# EAGLE design pidcontroller-less-pins (EAGLE 6.4)
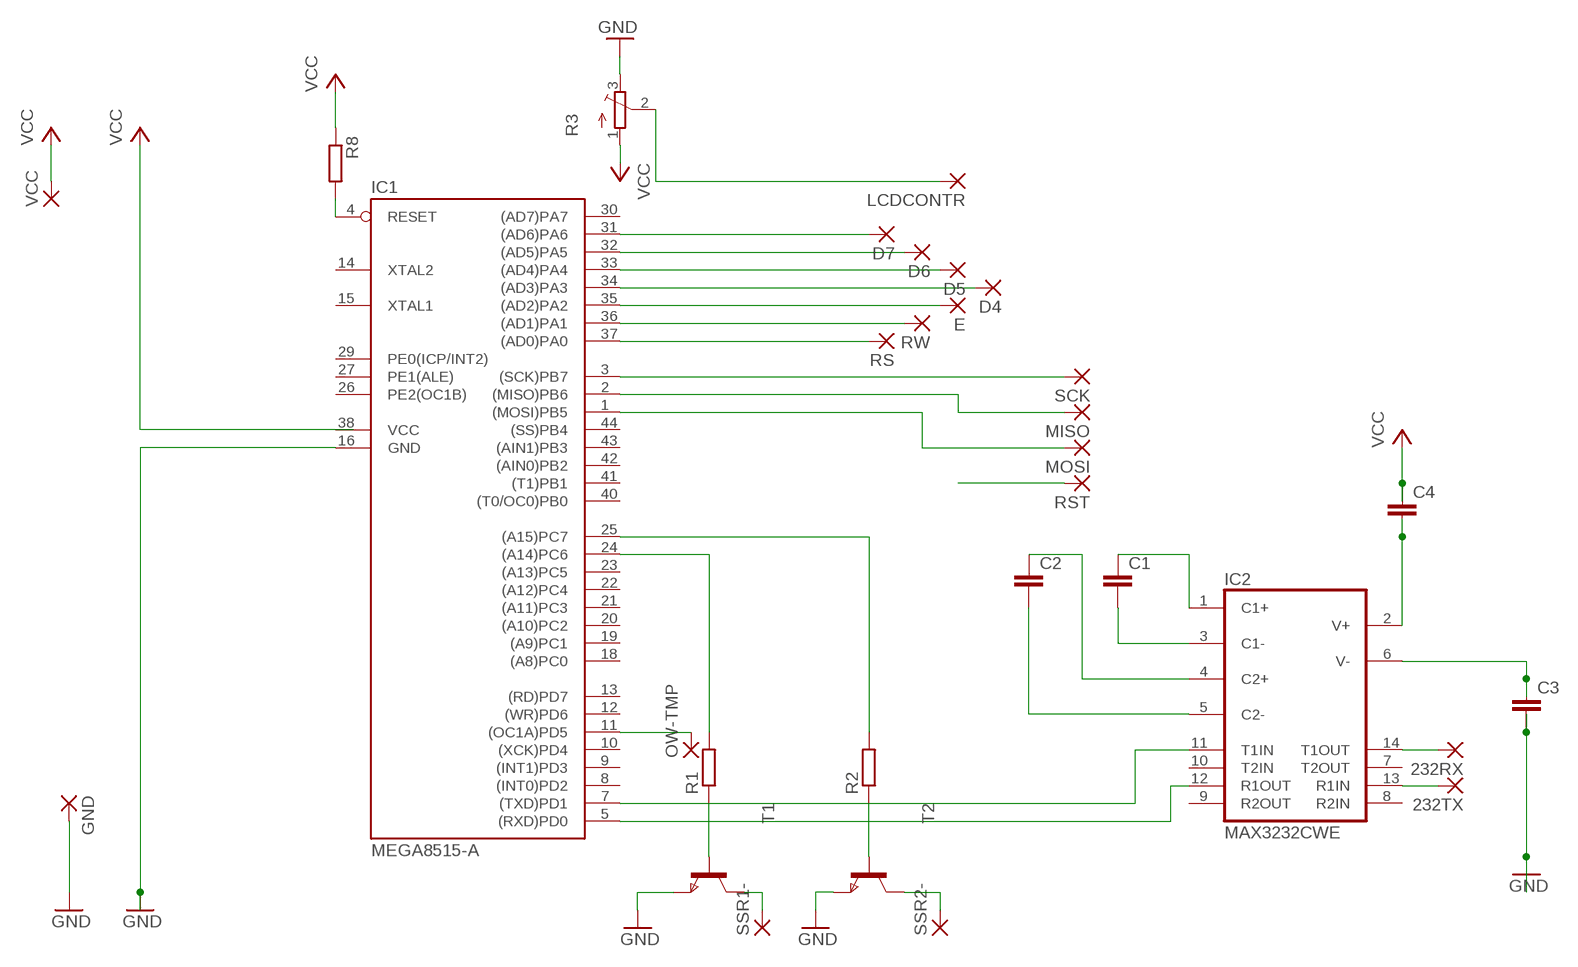
[diagram p0: schematic, sheet 1]

## Parts
232RX  2,54/1,0  [2,54/1,0]
232TX  2,54/1,0  [2,54/1,0]
C1  C-EUC1206  [C1206]
C2  C-EUC1206  [C1206]
C3  C-EUC1206  [C1206]
C4  C-EUC1206  [C1206]
D4  2,54/1,0  [2,54/1,0]
D5  2,54/1,0  [2,54/1,0]
D6  2,54/1,0  [2,54/1,0]
D7  2,54/1,0  [2,54/1,0]
E  2,54/1,0  [2,54/1,0]
GND  2,54/1,0  [2,54/1,0]
IC1  MEGA8515-A  [TQFP44]
IC2  MAX3232CWE  [SO16L]
LCDCONTR  2,54/1,0  [2,54/1,0]
MISO  2,54/1,0  [2,54/1,0]
MOSI  2,54/1,0  [2,54/1,0]
OW-TMP  2,15/1,0  [2,15/1,0]
R1  R-EU_R0603  [R0603]
R2  R-EU_R0603  [R0603]
R3  TRIM_EU-SM-42/43B  [SM-42/43B]
R8  R-EU_R0603  [R0603]
RS  2,54/1,0  [2,54/1,0]
RST  2,54/1,0  [2,54/1,0]
RW  2,54/1,0  [2,54/1,0]
SCK  2,54/1,0  [2,54/1,0]
SSR1-  2,15/1,0  [2,15/1,0]
SSR2-  2,15/1,0  [2,15/1,0]
T1  NPNSOT23  [SOT-23]
T2  NPNSOT23  [SOT-23]
VCC  2,54/1,0  [2,54/1,0]

## Nets
1: D6.1(P) IC1.32((AD5)PA5)
GND: C3.2 GND.1(P) IC1.16(GND) R3.3(E) T1.2(E) T2.2(E)
N$1: IC1.3((SCK)PB7) SCK.1(P)
N$2: R1.1 T1.3(B)
N$3: R2.1 T2.3(B)
N$4: IC1.24((A14)PC6) R1.2
N$5: C2.2 IC2.5(C2-)
N$6: C2.1 IC2.4(C2+)
N$7: C1.2 IC2.3(C1-)
N$8: C1.1 IC2.1(C1+)
N$9: C4.2 IC2.2(V+)
N$10: IC1.25((A15)PC7) R2.2
N$11: C3.1 IC2.6(V-)
N$12: IC1.7((TXD)PD1) IC2.11(T1IN)
N$13: IC1.5((RXD)PD0) IC2.12(R1OUT)
N$14: IC1.2((MISO)PB6) MISO.1(P)
N$15: IC1.1((MOSI)PB5) MOSI.1(P)
N$16: IC1.37((AD0)PA0) RS.1(P)
N$17: IC1.36((AD1)PA1) RW.1(P)
N$18: E.1(P) IC1.35((AD2)PA2)
N$19: D4.1(P) IC1.34((AD3)PA3)
N$20: D5.1(P) IC1.33((AD4)PA4)
N$21: IC1.11((OC1A)PD5) OW-TMP.1(P)
N$22: D7.1(P) IC1.31((AD6)PA6)
N$23: SSR1-.1(P) T1.1(C)
N$24: SSR2-.1(P) T2.1(C)
N$25: 232RX.1(P) IC2.14(T1OUT)
N$26: 232TX.1(P) IC2.13(R1IN)
N$27: LCDCONTR.1(P) R3.2(S)
RESET: IC1.4(RESET) R8.2 RST.1(P)
VCC: C4.1 R3.1(A) R8.1 VCC.1(P)
Unconnected: IC1.6(NC1) IC1.8((INT0)PD2) IC1.9((INT1)PD3) IC1.10((XCK)PD4) IC1.12((WR)PD6) IC1.13((RD)PD7) IC1.14(XTAL2) IC1.15(XTAL1) IC1.17(NC2) IC1.18((A8)PC0) IC1.19((A9)PC1) IC1.20((A10)PC2) IC1.21((A11)PC3) IC1.22((A12)PC4) IC1.23((A13)PC5) IC1.26(PE2(OC1B)) IC1.27(PE1(ALE)) IC1.28(NC3) IC1.29(PE0(ICP/INT2)) IC1.30((AD7)PA7) IC1.39(NC4) IC1.40((T0/OC0)PB0) IC1.41((T1)PB1) IC1.42((AIN0)PB2) IC1.43((AIN1)PB3) IC1.44((SS)PB4) IC2.7(T2OUT) IC2.8(R2IN) IC2.9(R2OUT) IC2.10(T2IN)

## Power pins joined to a net without a drawn wire
GND: IC2.15(GND)
VCC: IC1.38(VCC) IC2.16(VCC)

## Library data of the parts
232RX 232TX D4-D7 E GND LCDCONTR MISO MOSI RS RST RW SCK VCC = wirepad:2,54/1,0: THROUGH-HOLE PAD
C1-C4 = resistor:C-EU: CAPACITOR, European symbol
IC1 = atmel:MEGA8515: MICROCONTROLLER 8 Kbytes FLASH 512 bytes SRAM 512 bytes EEPROM USART 8-channel 10 bit ADC Source: avr.lbr; MPN: ATMEGA8515-16AU; OC_FARNELL: 9171410; OC_NEWARK: 01M6904
IC2 = maxim:MAX3232*: True RS-232 Transceivers 3.0V to 5.5V, Low-Power up to 1Mbps, Using Four 0.1µF External Capacitors Source: http://pdfserv.maxim-ic.com/en/ds/MAX3222-MAX3241.pdf; MF: MAXIM; MPN: MAX3232CWE+; OC_FARNELL: 9725504; OC_NEWARK: 68K4630
OW-TMP SSR1- SSR2- = wirepad:2,15/1,0: THROUGH-HOLE PAD
R1 R2 R8 = resistor:R-EU_: RESISTOR, European symbol
R3 = pot:TRIM_EU-: POTENTIOMETER
T1 T2 = zetex:NPNSOT23: NPN TRANSISTOR; MPN: DSS20201L-7; OC_FARNELL: 1710688; OC_NEWARK: 25R4555

## Net classes
0 default: width 0.381 mm, drill 0.762 mm, clearance 0.381 mm

## Board
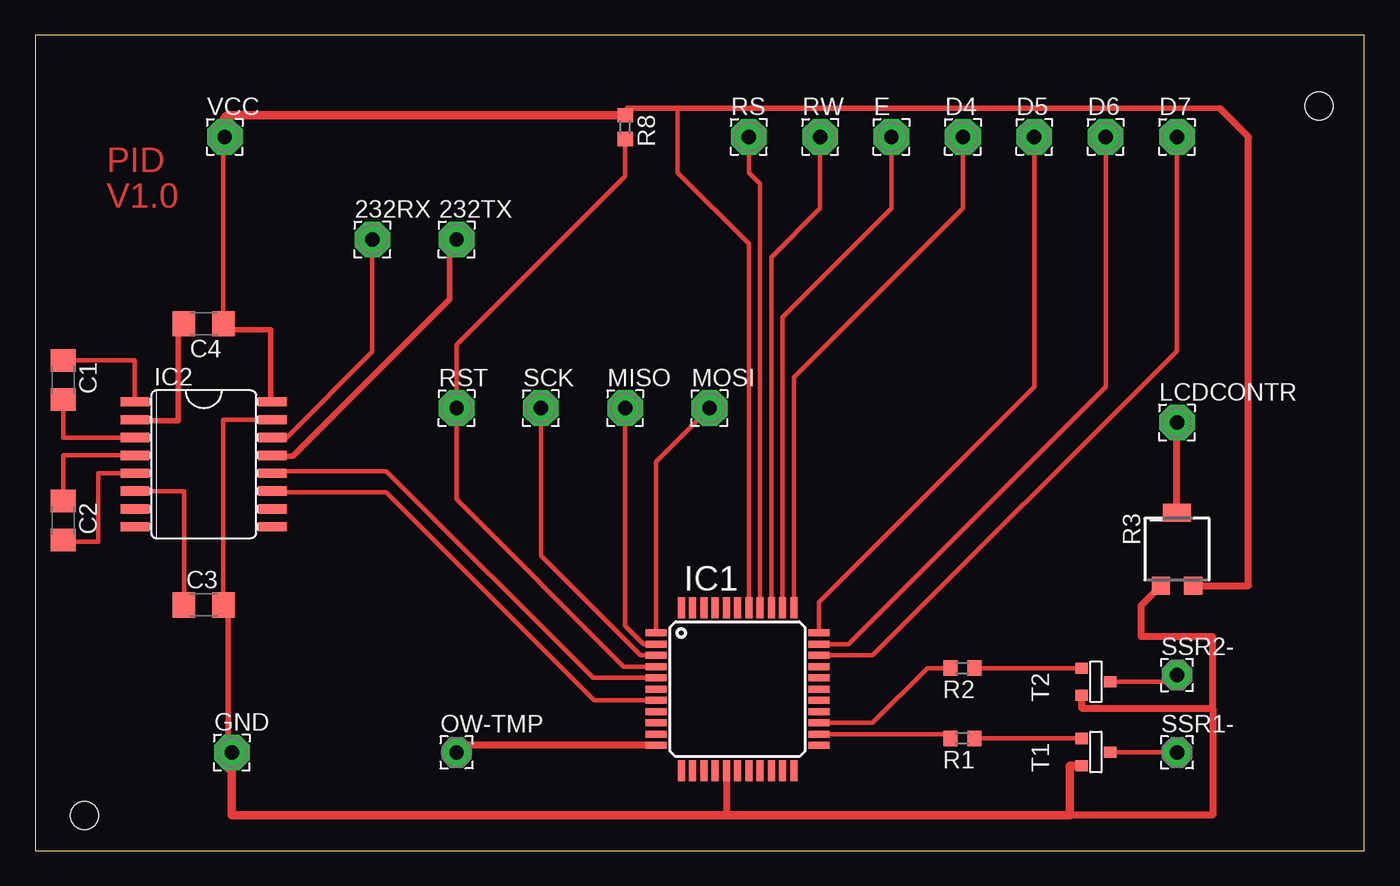
[diagram p1: board, top side]

Size 94.62 x 58.04 mm. Coordinates in mm from the lower left corner, seen from the top.
Outline: 0,0 94.62,0 94.62,58.04 0,58.04 0,0
Copper layers (1*16): Top 0.035mm / dielectric 1.5mm / Bottom 0.035mm
Design rules "default": minimum track width 10mil, minimum drill 24mil, track to track 8mil, track to pad 8mil, pad to pad 8mil, via to via 8mil, smd to smd 8mil, copper to edge 40mil, drill to drill 8mil, minimum pad ring 10mil, minimum via ring 8mil, stop-mask expansion 4mil, vias tented up to drill 0mil, thermal gap 10mil
Holes 2 mm at 3.5,2.5 91.4,53

### Footprints (pad centres in the part's own frame; a part is rotated, then mirrored left to right if it is on the bottom)
2,54/1,0 = drill 1.016 pad 2.54 octagon: 1 0,0
C1206 = smd 1.6 x 1.8: 1 -1.4,0; 2 1.4,0
TQFP44 = smd 1.5 x 0.5: 1 -5.8,4; 2 -5.8,3.2; 3 -5.8,2.4; 4 -5.8,1.6; 5 -5.8,0.8; 6 -5.8,0; 7 -5.8,-0.8; 8 -5.8,-1.6; 9 -5.8,-2.4; 10 -5.8,-3.2; 11 -5.8,-4; 23 5.8,-4; 24 5.8,-3.2; 25 5.8,-2.4; 26 5.8,-1.6; 27 5.8,-0.8; 28 5.8,0; 29 5.8,0.8; 30 5.8,1.6; 31 5.8,2.4; 32 5.8,3.2; 33 5.8,4 | smd 0.5 x 1.5: 12 -4,-5.8; 13 -3.2,-5.8; 14 -2.4,-5.8; 15 -1.6,-5.8; 16 -0.8,-5.8; 17 0,-5.8; 18 0.8,-5.8; 19 1.6,-5.8; 20 2.4,-5.8; 21 3.2,-5.8; 22 4,-5.8; 34 4,5.8; 35 3.2,5.8; 36 2.4,5.8; 37 1.6,5.8; 38 0.8,5.8; 39 0,5.8; 40 -0.8,5.8; 41 -1.6,5.8; 42 -2.4,5.8; 43 -3.2,5.8; 44 -4,5.8
SO16L = smd 0.66 x 2.032: 1 -4.445,-4.902; 2 -3.175,-4.902; 3 -1.905,-4.902; 4 -0.635,-4.902; 5 0.635,-4.902; 6 1.905,-4.902; 7 3.175,-4.902; 8 4.445,-4.902; 9 4.445,4.902; 10 3.175,4.902; 11 1.905,4.902; 12 0.635,4.902; 13 -0.635,4.902; 14 -1.905,4.902; 15 -3.175,4.902; 16 -4.445,4.902
2,15/1,0 = drill 1.016 pad 2.159 octagon: 1 0,0
R0603 = smd 1 x 1.1: 1 -0.85,0; 2 0.85,0
SM-42/43B = smd 1.3 x 1.3: 1 2.6,1.15; 3 2.6,-1.15 | smd 1.3 x 2: 2 -2.6,0
SOT-23 = smd 0.787 x 0.889: 1 0.025,-1.016; 2 -0.94,1.016; 3 0.991,1.016

### Placement (x,y rotation side)
232RX  24,43.5 0 top
232TX  30,43.5 0 top
C1  2,33.5 270 top
C2  2,23.5 270 top
C3  12,17.5 0 top
C4  12,37.5 180 top
D4  66.04,50.8 0 top
D5  71.12,50.8 0 top
D6  76.2,50.8 0 top
D7  81.28,50.8 0 top
E  60.96,50.8 0 top
GND  14,7 0 top
IC1  50,11.5 0 top
IC2  12,27.5 270 top
LCDCONTR  81.28,30.48 0 top
MISO  42,31.5 0 top
MOSI  48,31.5 0 top
OW-TMP  30,7 0 top
R1  66,8 180 top
R2  66,13 180 top
R3  81.28,21.46 270 top
R8  42,51.5 270 top
RS  50.8,50.8 0 top
RST  30,31.5 0 top
RW  55.88,50.8 0 top
SCK  36,31.5 0 top
SSR1-  81.28,7 0 top
SSR2-  81.28,12.5 0 top
T1  75.5,7 90 top
T2  75.5,12 90 top
VCC  13.5,50.8 0 top

### Tracks (layer width: path | path; a pad name or v marks a point on that pad's centre or on a via)
1
  Top 0.305: IC1.32 57.88,14.7 76.2,33.02 D6.1
GND
  Top 0.305: IC2.15 13.4,30.68 C3.2
  Top 0.381: C3.2 13.75,17.41 13.75,5.72 GND.1
  Top 0.508: IC1.16 49.2,2.54 48.26,2.54 | T2.2 74.48,10.16 83.82,10.16 | 83.82,10.16 83.82,2.54 73.66,2.54 | 83.82,10.16 83.82,15.24 78.74,15.24 78.74,17.47 R3.3
  Top 0.61: GND.1 14,2.54 48.26,2.54 73.66,2.54 73.66,6.06 T1.2
N$1
  Top 0.305: IC1.3 43.1,13.9 36,21 SCK.1
N$2
  Top 0.305: R1.1 T1.3
N$3
  Top 0.305: R2.1 T2.3
N$4
  Top 0.305: IC1.24 64.85,8.3 R1.2
N$5
  Top 0.305: IC2.5 4.5,26.86 4.5,22 2,22 C2.2
  Top 0.381: 2.06,21.98 C2.2
N$6
  Top 0.305: IC2.4 2,28.14 C2.1
  Top 0.381: 2.06,25.03 C2.1
N$7
  Top 0.305: IC2.3 2,29.41 C1.2
N$8
  Top 0.305: IC2.1 7.1,34.9 C1.1
N$9
  Top 0.381: C4.2 10.19,37.22 10.19,30.62 7.14,30.62 IC2.2
N$10
  Top 0.305: IC1.25 59.6,9.1 63.5,13 R2.2
N$11
  Top 0.305: IC2.6 10.6,25.59 C3.1
N$12
  Top 0.305: IC1.7 39.8,10.7 25,25.5 17,25.5 IC2.11
N$13
  Top 0.305: IC1.5 39.7,12.3 25,27 17.04,27 IC2.12
N$14
  Top 0.305: IC1.2 43.3,14.7 42,16 MISO.1
N$15
  Top 0.305: IC1.1 44.2,27.7 MOSI.1
N$16
  Top 0.305: IC1.37 51.6,47.46 50.8,48.26 RS.1
N$17
  Top 0.305: IC1.36 52.4,42.24 55.88,45.72 RW.1
N$18
  Top 0.305: IC1.35 53.2,37.96 60.96,45.72 E.1
N$19
  Top 0.305: IC1.34 54,33.68 66.04,45.72 D4.1
N$20
  Top 0.305: IC1.33 55.8,17.7 71.12,33.02 D5.1
N$21
  Top 0.508: IC1.11 30.5,7.5 OW-TMP.1
N$22
  Top 0.305: IC1.31 59.62,13.9 81.28,35.56 D7.1
N$23
  Top 0.305: T1.1 81.47,7.03 SSR1-.1
N$24
  Top 0.305: T2.1 81.03,12.03 SSR2-.1
N$25
  Top 0.305: IC2.14 17.91,29.41 24,35.5 232RX.1
N$26
  Top 0.381: IC2.13 17.3,28.08 18.32,28.08 29.5,39.25 29.5,43.32 232TX.1
N$27
  Top 0.508: R3.2 LCDCONTR.1
RESET
  Top 0.305: R8.2 42,48 30,36 RST.1 30,25 41.9,13.1 IC1.4
VCC
  Top 0.305: C4.1 13.4,51.9 VCC.1 | IC1.38 50.8,43.18 45.72,48.26 45.72,52.83
  Top 0.381: 13.75,37.22 C4.1 13.72,37.08 16.76,37.08 16.76,32 IC2.16 | 84.33,52.83 45.72,52.83 42.16,52.83 R8.1
  Top 0.508: R3.1 86.36,18.86 86.36,50.8 84.33,52.83
  Top 0.61: R8.1 13.85,52.35 arc90 13.4,51.9

### Text on the board
Top: PID | V1.0